# EAGLE design PCB-MicroVU (EAGLE 7.5.0)
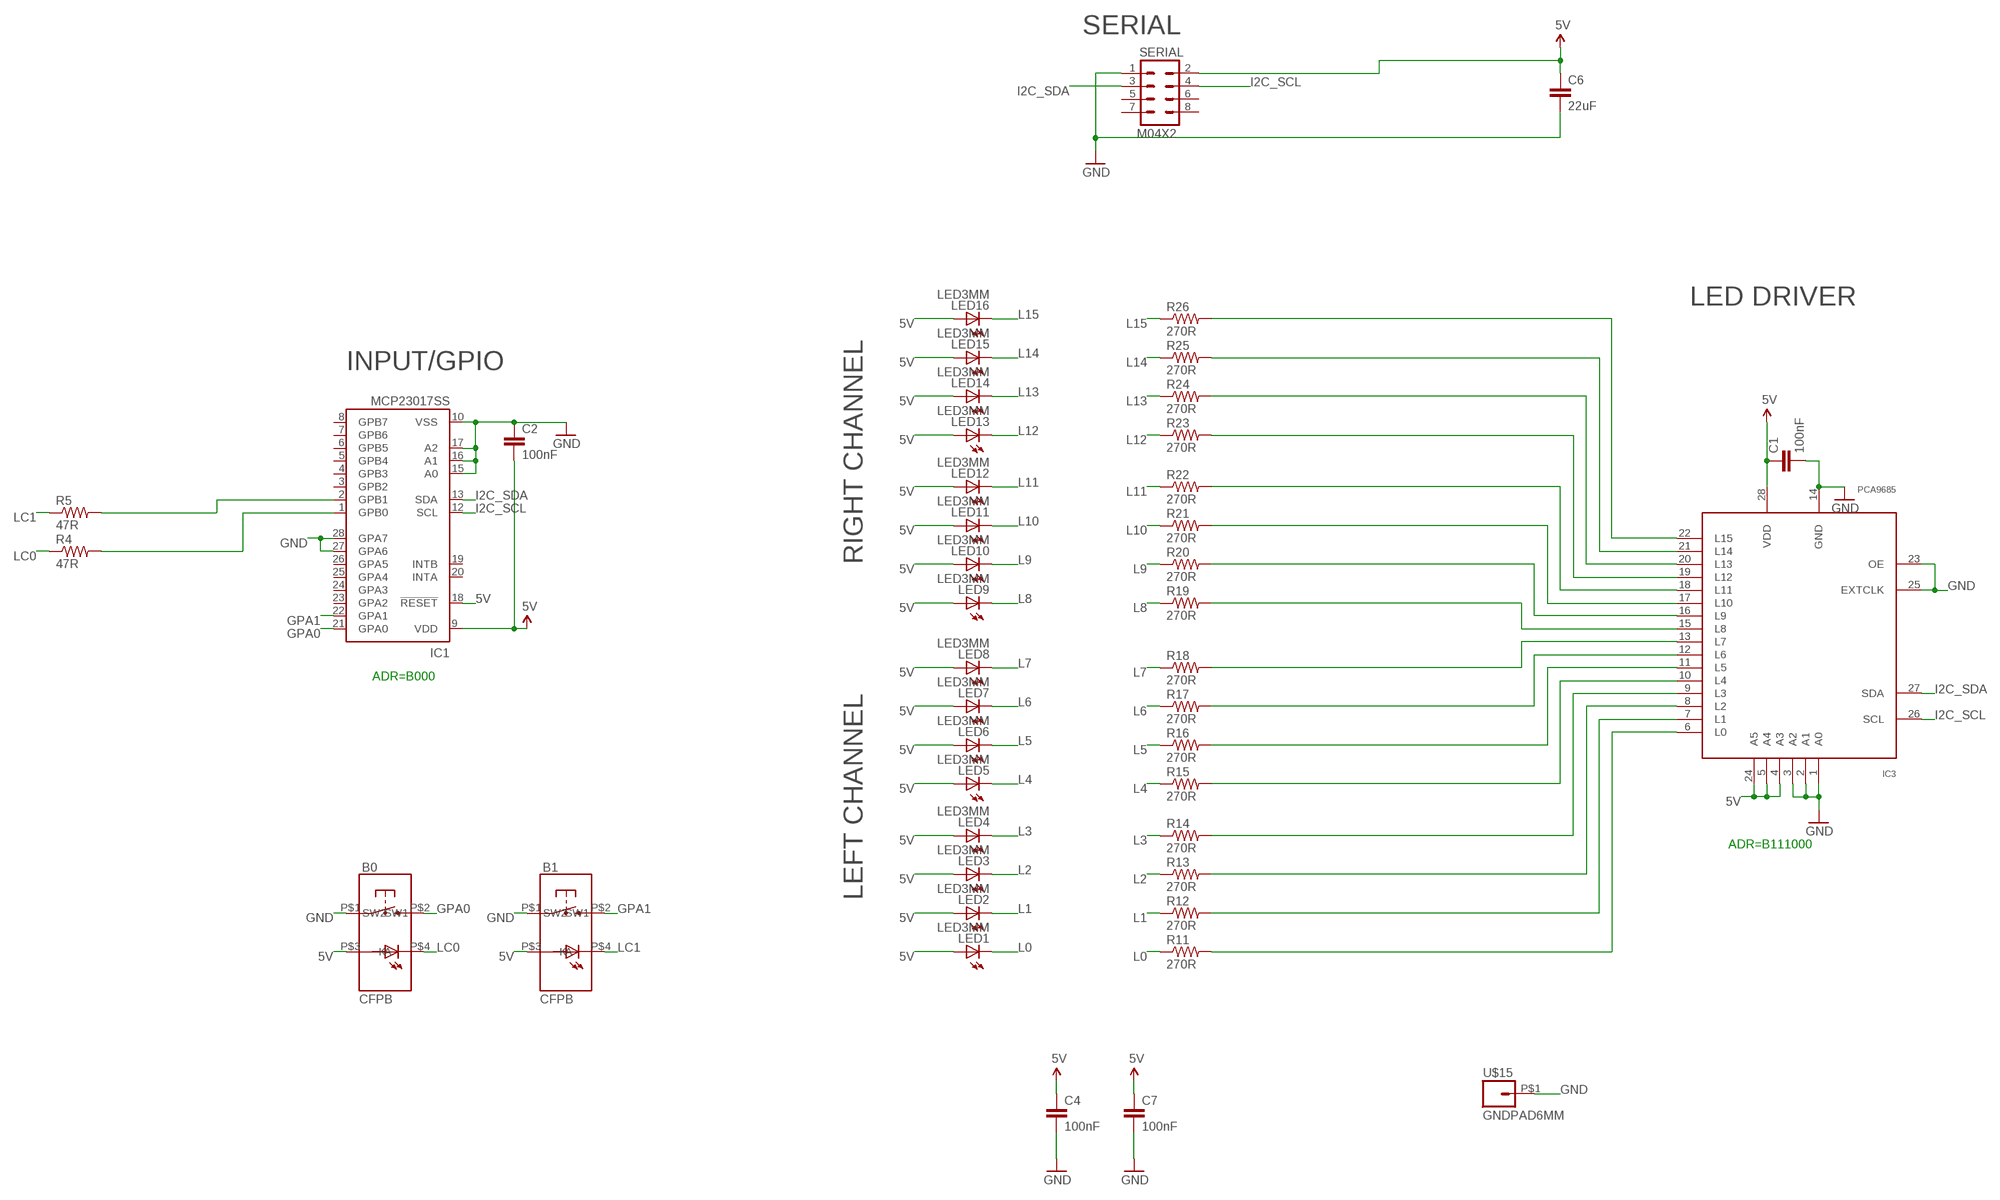
[diagram p0: schematic, sheet 1]

## Parts
B0  CFPB  [CFPB-6/9MM]
B1  CFPB  [CFPB-6/9MM]
C1  100nF  CAP0603-CAP  [0603-CAP]
C2  100nF  CAP0603-CAP  [0603-CAP]
C4  100nF  CAP0603-CAP  [0603-CAP]
C6  22uF  CAP0805  [0805]
C7  100nF  CAP0603-CAP  [0603-CAP]
IC1  MCP23017SS  [SSOP28]
IC3  PCA9685  [TSSOP28]
LED1  LED3MM  [LED3MM]
LED2  LED3MM  [LED3MM]
LED3  LED3MM  [LED3MM]
LED4  LED3MM  [LED3MM]
LED5  LED3MM  [LED3MM]
LED6  LED3MM  [LED3MM]
LED7  LED3MM  [LED3MM]
LED8  LED3MM  [LED3MM]
LED9  LED3MM  [LED3MM]
LED10  LED3MM  [LED3MM]
LED11  LED3MM  [LED3MM]
LED12  LED3MM  [LED3MM]
LED13  LED3MM  [LED3MM]
LED14  LED3MM  [LED3MM]
LED15  LED3MM  [LED3MM]
LED16  LED3MM  [LED3MM]
R4  47R  RESISTOR0603-RES  [0603-RES]
R5  47R  RESISTOR0603-RES  [0603-RES]
R11  270R  RESISTOR0603-RES  [0603-RES]
R12  270R  RESISTOR0603-RES  [0603-RES]
R13  270R  RESISTOR0603-RES  [0603-RES]
R14  270R  RESISTOR0603-RES  [0603-RES]
R15  270R  RESISTOR0603-RES  [0603-RES]
R16  270R  RESISTOR0603-RES  [0603-RES]
R17  270R  RESISTOR0603-RES  [0603-RES]
R18  270R  RESISTOR0603-RES  [0603-RES]
R19  270R  RESISTOR0603-RES  [0603-RES]
R20  270R  RESISTOR0603-RES  [0603-RES]
R21  270R  RESISTOR0603-RES  [0603-RES]
R22  270R  RESISTOR0603-RES  [0603-RES]
R23  270R  RESISTOR0603-RES  [0603-RES]
R24  270R  RESISTOR0603-RES  [0603-RES]
R25  270R  RESISTOR0603-RES  [0603-RES]
R26  270R  RESISTOR0603-RES  [0603-RES]
SERIAL  M04X2  [2X4]
U$15  GNDPAD6MM  [3.2MMPAD6MM]

## Nets
5V [Power]: B0.P$3(A) B1.P$3(A) C1.1 C2.2 C4.1 C6.1 C7.1 IC1.9(VDD) IC1.18(!RESET) IC3.4(A3) IC3.5(A4) IC3.24(A5) IC3.28(VDD) LED1.A LED2.A LED3.A LED4.A LED5.A LED6.A LED7.A LED8.A LED9.A LED10.A LED11.A LED12.A LED13.A LED14.A LED15.A LED16.A SERIAL.2
GND [Power]: B0.P$1(SW1) B1.P$1(SW1) C1.2 C2.1 C4.2 C6.2 C7.2 IC1.10(VSS) IC1.15(A0) IC1.16(A1) IC1.17(A2) IC1.27(GPA6) IC1.28(GPA7) IC3.1(A0) IC3.2(A1) IC3.3(A2) IC3.14(GND) IC3.23(OE) IC3.25(EXTCLK) SERIAL.1 U$15.P$1
GPA0 [Signal]: B0.P$2(SW2) IC1.21(GPA0)
GPA1 [Signal]: B1.P$2(SW2) IC1.22(GPA1)
I2C_SCL: IC1.12(SCL) IC3.26(SCL) SERIAL.4
I2C_SDA: IC1.13(SDA) IC3.27(SDA) SERIAL.3
L0: LED1.K(C) R11.1
L1: LED2.K(C) R12.1
L2: LED3.K(C) R13.1
L3: LED4.K(C) R14.1
L4: LED5.K(C) R15.1
L5: LED6.K(C) R16.1
L6: LED7.K(C) R17.1
L7: LED8.K(C) R18.1
L8: LED9.K(C) R19.1
L9: LED10.K(C) R20.1
L10: LED11.K(C) R21.1
L11: LED12.K(C) R22.1
L12: LED13.K(C) R23.1
L13: LED14.K(C) R24.1
L14: LED15.K(C) R25.1
L15: LED16.K(C) R26.1
LC0: B0.P$4(K) R4.1
LC1: B1.P$4(K) R5.1
N$1: IC1.2(GPB1) R5.2
N$16: IC1.1(GPB0) R4.2
N$22: IC3.6(L0) R11.2
N$27: IC3.19(L12) R23.2
N$29: IC3.21(L14) R25.2
N$37: IC3.13(L7) R18.2
N$38: IC3.12(L6) R17.2
N$39: IC3.11(L5) R16.2
N$40: IC3.10(L4) R15.2
N$41: IC3.9(L3) R14.2
N$42: IC3.8(L2) R13.2
N$43: IC3.7(L1) R12.2
N$45: IC3.15(L8) R19.2
N$46: IC3.16(L9) R20.2
N$47: IC3.17(L10) R21.2
N$48: IC3.18(L11) R22.2
N$50: IC3.20(L13) R24.2
N$52: IC3.22(L15) R26.2
Unconnected: IC1.3(GPB2) IC1.4(GPB3) IC1.5(GPB4) IC1.6(GPB5) IC1.7(GPB6) IC1.8(GPB7) IC1.19(INTB) IC1.20(INTA) IC1.23(GPA2) IC1.24(GPA3) IC1.25(GPA4) IC1.26(GPA5) SERIAL.5 SERIAL.6 SERIAL.7 SERIAL.8

## Notes on the sheet
- SERIAL
- LED DRIVER
- INPUT/GPIO
- RIGHT CHANNEL
- ADR=B000
- ADR=B111000
- LEFT CHANNEL

## Library data of the parts
B0 B1 = SKAARHOJ:CFPB
C1 C2 C4 C6 C7 = SparkFun:CAP: Capacitor Standard 0603 ceramic capacitor, and 0.1" leaded capacitor.
IC1 = microchip:MCP23017: http://ww1.microchip.com/downloads/en/DeviceDoc/21952a.pdf Source: http://ww1.microchip.com/downloads/en/DeviceDoc/21952a.pdf; MF: MICROCHIP; MPN: MCP23017-E/SS; OC_FARNELL: 1467674; OC_NEWARK: 31K2960
IC3 = wsmith:PCA9685
LED1-LED16 = SKAARHOJ:LED: KINGBRIGHT 20MM BIG LAMP
R4 R5 R11-R26 = SparkFun:RESISTOR: Resistor Basic schematic elements and footprints for 0603, 1206, and PTH resistors.
SERIAL = SparkFun:M04X2
U$15 = SKAARHOJ:GNDPAD

## Net classes
0 default: width 0.203 mm, drill 0.406 mm, clearance 0.152 mm
1 Power: width 0.406 mm, drill 0.61 mm, clearance 0.203 mm
2 Signal: width 0.203 mm, clearance 0.203 mm

## Board
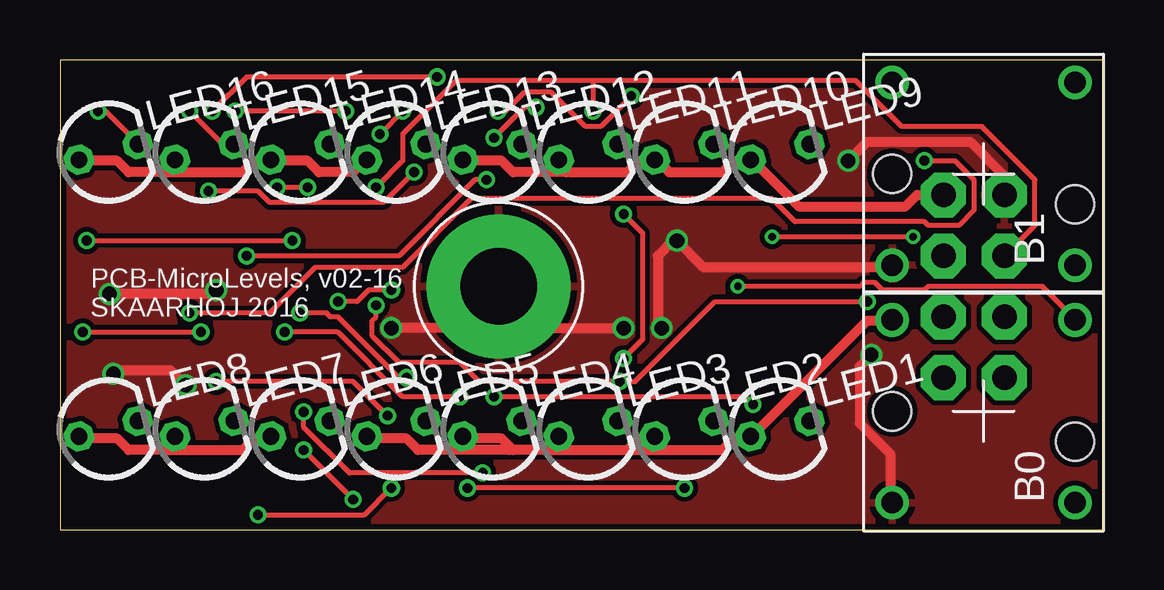
[diagram p1: board, top side]
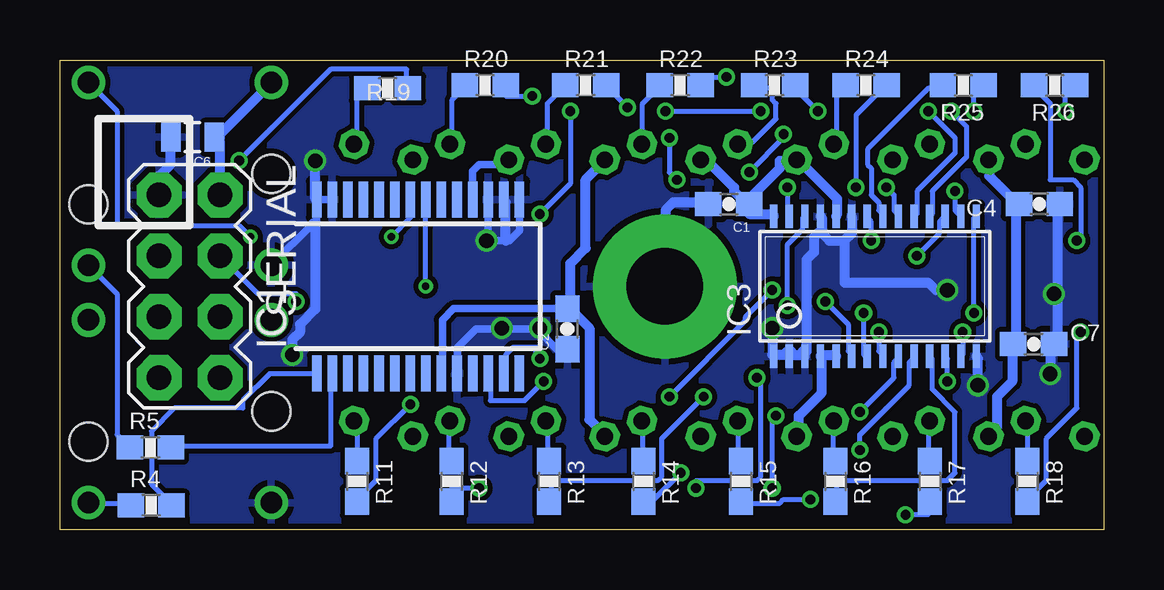
[diagram p2: board, bottom side, seen from below]

Size 43.5 x 19.6 mm. Coordinates in mm from the lower left corner, seen from the top.
Outline: 0,0 43.5,0 43.5,19.6 0,19.6 0,0
Copper layers (1*16): Top 0.035mm / dielectric 1.5mm / Bottom 0.035mm
Design rules "Fusion_eagle_rule_v1.1": minimum track width 6mil, minimum drill 12mil, track to track 6mil, track to pad 6mil, pad to pad 6mil, via to via 6mil, smd to smd 0mil, copper to edge 10mil, drill to drill 10mil, minimum pad ring 10mil, minimum via ring 6mil, stop-mask expansion 2mil, vias tented up to drill 100mil, thermal gap 10mil

### Footprints (pad centres in the part's own frame; a part is rotated, then mirrored left to right if it is on the bottom)
CFPB-6/9MM = drill 0.9: P$1 -3.81,3.81; P$2 3.81,-3.81; P$3 3.81,3.81; P$4 -3.81,-3.81 | hole 1.6: 0,3.81; -1.27,-3.81
0603-CAP = smd 1.1 x 1: 1 -0.85,0; 2 0.85,0
0805 = smd 0.8 x 1.2: 1 -0.9,0; 2 0.9,0
SSOP28 = smd 0.4 x 1.5: 1 -4.225,-3.625; 2 -3.575,-3.625; 3 -2.925,-3.625; 4 -2.275,-3.625; 5 -1.625,-3.625; 6 -0.975,-3.625; 7 -0.325,-3.625; 8 0.325,-3.625; 9 0.975,-3.625; 10 1.625,-3.625; 11 2.275,-3.625; 12 2.925,-3.625; 13 3.575,-3.625; 14 4.225,-3.625; 15 4.225,3.625; 16 3.575,3.625; 17 2.925,3.625; 18 2.275,3.625; 19 1.625,3.625; 20 0.975,3.625; 21 0.325,3.625; 22 -0.325,3.625; 23 -0.975,3.625; 24 -1.625,3.625; 25 -2.275,3.625; 26 -2.925,3.625; 27 -3.575,3.625; 28 -4.225,3.625
TSSOP28 = smd 0.305 x 0.991: 1 -4.225,-2.918; 2 -3.575,-2.918; 3 -2.925,-2.918; 4 -2.275,-2.918; 5 -1.625,-2.918; 6 -0.975,-2.918; 7 -0.325,-2.918; 8 0.325,-2.918; 9 0.975,-2.918; 10 1.625,-2.918; 11 2.275,-2.918; 12 2.925,-2.918; 13 3.575,-2.918; 14 4.225,-2.918; 15 4.225,2.918; 16 3.575,2.918; 17 2.925,2.918; 18 2.275,2.918; 19 1.625,2.918; 20 0.975,2.918; 21 0.325,2.918; 22 -0.325,2.918; 23 -0.975,2.918; 24 -1.625,2.918; 25 -2.275,2.918; 26 -2.925,2.918; 27 -3.575,2.918; 28 -4.225,2.918
LED3MM = drill 0.7 pad 1.2 octagon: A -1.27,0; K 1.27,0
0603-RES = smd 1.1 x 1: 1 -0.85,0; 2 0.85,0
2X4 = drill 1.016 pad 1.88 octagon: 1 -3.81,-1.27; 2 -3.81,1.27; 3 -1.27,-1.27; 4 -1.27,1.27; 5 1.27,-1.27; 6 1.27,1.27; 7 3.81,-1.27; 8 3.81,1.27
3.2MMPAD6MM = drill 3.2 pad 6: P$1 0,0

### Placement (x,y rotation side)
B0  38.5,4.95 90 top
B1  38.5,14.85 90 top
C1  15.62,13.59 180 bottom
C2  22.35,8.38 90 bottom
C4  2.67,13.59 0 bottom
C6  37.97,16.38 180 bottom
C7  2.92,7.75 0 bottom
IC1  28.57,10.16 0 bottom
IC3  9.53,10.16 0 bottom
LED1  30.02,4.22 15 top
LED2  26.02,4.22 15 top
LED3  22.02,4.22 15 top
LED4  18.02,4.22 15 top
LED5  14.02,4.22 15 top
LED6  10.02,4.22 15 top
LED7  6.02,4.22 15 top
LED8  2.02,4.22 15 top
LED9  30.02,15.77 15 top
LED10  26.02,15.77 15 top
LED11  22.02,15.77 15 top
LED12  18.02,15.77 15 top
LED13  14.02,15.77 15 top
LED14  10.02,15.77 15 top
LED15  6.02,15.77 15 top
LED16  2.02,15.77 15 top
R4  39.7,1.02 0 bottom
R5  39.73,3.44 0 bottom
R11  31.11,2.03 270 bottom
R12  27.18,2.03 270 bottom
R13  23.11,2.03 270 bottom
R14  19.18,2.03 270 bottom
R15  15.11,2.03 270 bottom
R16  11.18,2.03 270 bottom
R17  7.24,2.03 270 bottom
R18  3.17,2.03 270 bottom
R19  29.84,18.41 0 bottom
R20  25.77,18.54 0 bottom
R21  21.58,18.54 0 bottom
R22  17.65,18.54 0 bottom
R23  13.71,18.54 0 bottom
R24  9.9,18.54 0 bottom
R25  5.85,18.54 180 bottom
R26  2.04,18.54 180 bottom
SERIAL  38.1,10.16 270 bottom
U$15  18.29,10.16 0 top

### Tracks (layer width: path | path; a pad name or v marks a point on that pad's centre or on a via)
5V
  Top 0.406: 18.81,3.41 18.89,3.33 20.16,3.33 | 18.81,3.41 18.41,3.81 16.83,3.81 LED4.A | 20.16,3.33 20.64,3.81 LED3.A | 23.73,3.41 23.65,3.33 20.16,3.33 | 23.73,3.41 24.13,3.81 24.77,3.81 LED2.A | 23.73,3.41 23.81,3.33 27.62,3.33 28.1,3.81 28.73,3.81 LED1.A 28.89,3.97 33.66,8.73 34.61,8.73 B0.P$3 | LED5.A 12.86,3.81 14.45,3.81 14.92,3.33 18.73,3.33 18.81,3.41 | 4.29,3.33 2.86,3.33 2.38,3.81 0.79,3.81 LED8.A | 4.29,3.33 4.76,3.81 LED7.A | 4.29,3.33 7.62,3.33 8.1,3.81 8.73,3.81 LED6.A | 4.29,14.92 2.86,14.92 2.38,15.4 0.79,15.4 LED16.A | 4.29,14.92 4.76,15.4 LED15.A | 4.29,14.92 7.62,14.92 8.1,15.4 8.73,15.4 LED14.A 8.89,15.4 10.32,15.4 10.79,14.92 12.22,14.92 12.7,15.4 LED13.A | LED12.A 16.83,15.4 18.41,15.4 18.89,14.92 21.11,14.92 LED11.A 20.8,15.4 21.27,14.92 23.65,14.92 24.13,15.4 24.61,15.4 LED10.A 24.92,15.4 25.4,14.92 27.62,14.92 28.1,15.4 28.73,15.4 LED9.A 28.89,15.4 30.8,13.49 35.24,13.49 35.72,13.97 SERIAL.2
  Bottom 0.305: C2.2 27.09,9.23 27.56,8.76 27.56,6.58 IC1.9 | IC1.18 26.3,14.97 26.04,15.24 24.99,15.24 LED10.A
  Bottom 0.406: IC3.5 11.27,7.3 11.75,7.3 IC3.4 11.75,7.14 11.75,5.71 12.7,4.76 12.7,3.97 LED5.A | LED15.A 4.76,15.4 4.76,14.76 3.65,13.65 C4.1 3.65,13.49 3.65,7.78 C7.1 3.81,7.62 3.81,6.19 4.45,5.56 4.45,4.29 4.76,3.97 LED7.A | SERIAL.2 36.83,16.19 36.99,16.35 C6.1 36.83,16.35 36.83,16.51 34.77,18.57 B1.P$3 | IC3.24 11.11,13.18 11.11,13.81 12.7,15.4 LED13.A 12.86,15.4 13.49,15.4 13.49,15.08 14.61,13.97 14.61,13.65 C1.1 | IC3.28 13.81,13.18 14.76,13.18 14.76,13.49 C1.1 | C1.1 14.92,13.65 15.4,14.13 15.4,14.29 16.67,15.56 LED12.A | LED11.A 20.8,15.4 21.59,14.61 21.59,11.75 22.23,11.11 22.23,9.37 C2.2 22.23,9.21 21.43,8.41 21.43,4.6 20.8,3.97 LED3.A
GND  (via drill 0.61)
  Top 0.406: B1.P$1 34.61,10.95 26.83,10.95 v25.72,12.06 25.56,12.06 24.92,11.43 24.92,8.57 v25.08,8.41 | v33.81,7.3 33.34,6.83 33.34,4.45 34.61,3.17 34.61,1.27 B0.P$1 | SERIAL.1 39.37,14.76 37.94,16.19 33.66,16.19 v32.86,15.4 | v5.24,6.03 4.6,6.67 2.38,6.67 v2.22,6.51 | v13.81,8.41 16.51,8.41 18.26,10.16 U$15.P$1 18.41,10 20,8.41 v23.5,8.41 | v2.06,9.84 6.35,9.84 v6.51,10
  Bottom 0.305: C2.1 22.77,7.53 23.57,8.33 23.62,8.38 25.08,8.38 26.16,8.38 26.92,7.62 26.92,6.56 IC1.10 | IC1.15 24.35,12.48 24.77,12.06 24.92,12.06 25.4,12.06 25.64,12.3 25.65,12.32 IC1.17 | IC1.27 IC1.28 32.8,12.93 32.95,12.78 B1.P$1
  Bottom 0.406: SERIAL.1 39.37,14.76 38.89,15.24 38.89,16.35 C6.2 | 24.92,12.06 24.92,13.65 IC1.16 | v25.72,12.06 25.72,12.22 25.64,12.3 | v33.81,7.3 33.81,7.94 33.5,8.26 33.5,8.57 32.86,9.21 32.86,12.7 32.95,12.78 | v25.08,8.41 25.08,8.38 | v32.86,15.4 32.86,13.81 IC1.28 | v5.24,6.03 5.24,7.14 IC3.14 | v2.22,6.51 2.22,7.62 C7.2 1.91,7.78 1.91,9.84 | 1.91,9.84 1.91,13.49 C4.2 | 10.79,12.06 10.48,12.38 10.48,13.02 IC3.23 | 10.79,12.06 11.43,12.06 11.75,12.38 | 11.75,12.38 11.75,13.02 IC3.25 | 11.75,12.38 11.91,12.38 12.06,12.22 12.06,11.59 12.38,11.27 12.38,7.46 12.54,7.46 IC3.3 12.54,7.3 13.02,7.3 IC3.2 13.02,7.46 13.18,7.46 13.34,7.3 13.65,7.3 IC3.1 13.81,7.3 v13.81,8.41 | U$15.P$1 18.26,10.16 18.26,13.34 17.94,13.65 16.51,13.65 C1.2 | v6.51,10 6.99,10 7.3,10.32 10.79,10.32 10.79,12.06 | v2.06,9.84 1.91,9.84 | v23.5,8.41 23.57,8.33
  pour Top: 0,0 43.81,0 43.81,19.68 0,19.68
  pour Bottom: 0,0 43.81,0 43.81,19.68 0,19.68
GPA0  (via drill 0.3)
  Top 0.203: v28.26,10.16 33.34,10.16 33.5,10.32 33.97,10.32 34.29,10 36.04,10 36.2,10.16 40.96,10.16 42.23,8.89 B0.P$2
  Bottom 0.203: v28.26,10.16 28.26,13.65 IC1.21
GPA1  (via drill 0.3)
  Top 0.203: v35.56,12.22 v29.69,12.22
  Bottom 0.203: v29.69,12.22 28.89,13.02 28.89,13.65 IC1.22 | v35.56,12.22 36.04,12.7 41.12,12.7 41.12,17.46 42.23,18.57 B1.P$2
I2C_SCL  (via drill 0.41)
  Top 0.203: v13.18,9.37 13.18,8.89 13.02,8.73 13.02,8.1 14.13,6.99 16.67,6.99 17.46,6.19 v23.34,6.19 23.97,6.19 27.3,9.53 v33.66,9.53
  Bottom 0.203: v13.18,9.37 13.18,11.91 12.54,12.54 12.54,13.02 IC3.26 | v23.34,6.19 24.13,5.4 25.56,5.4 25.56,6.51 IC1.12 | SERIAL.4 35.24,9.84 33.66,9.84 v33.66,9.53
I2C_SDA  (via drill 0.41)
  Top 0.203: v13.18,14.29 14.29,15.4 14.29,16.51 16.51,18.73 22.23,18.73 | 22.23,18.73 33.18,18.73 35.08,16.83 38.42,16.83 40.64,14.61 40.64,12.7 SERIAL.3 | v23.5,7.14 24.29,7.94 24.29,12.38 v23.5,13.18 | 22.23,18.73 v22.23,17.46
  Bottom 0.203: v13.18,14.29 13.18,13.18 IC3.27 | v23.5,7.14 23.65,7.3 23.65,7.62 24.61,7.62 24.92,7.3 24.92,6.67 IC1.13 | v23.5,13.18 22.23,14.45 v22.23,17.46
L0
  Bottom 0.203: R11.1 31.11,4.45 LED1.K
L1
  Bottom 0.203: R12.1 27.3,3.02 27.3,4.45 LED2.K
L2
  Bottom 0.203: R13.1 23.18,3.02 23.18,4.45 LED3.K
L3
  Bottom 0.203: R14.1 19.21,3.02 19.21,4.45 LED4.K
L4
  Bottom 0.203: R15.1 15.24,3.02 15.24,4.45 LED5.K
L5
  Bottom 0.203: R16.1 11.27,3.02 11.27,4.45 LED6.K
L6
  Bottom 0.203: R17.1 7.3,3.02 7.3,4.45 LED7.K
L7
  Bottom 0.203: R18.1 3.17,4.45 LED8.K
L8
  Bottom 0.203: R19.1 30.8,18.41 31.11,18.1 31.11,16.19 LED9.K
L9
  Bottom 0.203: R20.1 26.67,18.41 27.15,17.94 27.15,16.19 LED10.K
L10
  Bottom 0.203: R21.1 22.54,18.41 23.18,17.78 23.18,16.19 LED11.K
L11
  Bottom 0.203: R22.1 18.57,18.41 19.21,17.78 19.21,16.19 LED12.K
L12
  Bottom 0.203: R23.1 14.45,18.41 13.81,18.41 13.81,17.94 13.65,17.78 13.65,17.14 14.61,16.19 15.24,16.19 LED13.K
L13
  Bottom 0.203: R24.1 10.79,18.41 11.11,18.1 11.11,16.19 LED14.K
L14  (via drill 0.41)
  Top 0.203: v5.4,17.46 6.67,16.19 7.14,16.19 LED15.K
  Bottom 0.203: v5.4,17.46 5.4,18.1 5.08,18.41 R25.1
L15  (via drill 0.41)
  Top 0.203: v1.59,17.46 1.91,17.46 3.17,16.19 LED16.K
  Bottom 0.203: v1.59,17.46 1.59,18.1 1.27,18.41 R26.1
LC0
  Bottom 0.203: R4.1 40.64,1.11 42.23,1.11 B0.P$4
LC1
  Bottom 0.203: R5.1 40.64,3.49 41.12,3.97 41.12,9.84 42.23,10.95 B1.P$4
N$1
  Bottom 0.203: R5.2 38.73,3.49 32.23,3.49 32.23,6.51 IC1.2
N$16
  Bottom 0.203: R4.2 38.89,1.11 39.69,1.91 39.69,4.13 38.73,5.08 35.88,5.08 35.88,5.4 34.77,6.51 32.86,6.51 IC1.1
N$22  (via drill 0.41)
  Top 0.203: v11.59,9.53 12.38,9.53 12.86,10 v13.81,10 | v18.1,5.56 28.57,5.56 v28.89,5.24
  Bottom 0.203: v11.59,9.53 10.64,8.57 10.64,7.46 10.48,7.3 IC3.6 | v13.81,10 14.92,8.89 14.92,8.73 v18.1,5.56 | v28.89,5.24 30.32,3.81 30.32,2.06 31.11,1.27 R11.2
N$27  (via drill 0.41)
  Top 0.203: v11.91,17.46 v7.3,17.46
  Bottom 0.203: v7.3,17.46 6.19,16.35 6.19,15.72 7.78,14.13 7.78,13.18 IC3.19 | v11.91,17.46 12.86,18.41 R23.2
N$29
  Bottom 0.203: IC3.21 9.21,13.18 9.37,13.34 9.37,13.65 9.68,13.97 9.68,15.08 9.84,15.24 9.84,15.88 7.3,18.41 6.83,18.41 R25.2
N$37  (via drill 0.41)
  Top 0.203: v0.95,8.26 v5.87,8.26
  Bottom 0.203: v5.87,8.26 5.87,7.3 IC3.13 | v0.95,8.26 1.11,8.1 1.11,5.08 2.38,3.81 2.38,2.06 3.17,1.27 R18.2
N$38  (via drill 0.41)
  Top 0.203: v6.51,6.19 12.22,6.19 v13.65,4.76 | v13.81,1.75 12.7,0.64 v8.26,0.64
  Bottom 0.203: v6.51,6.19 6.51,7.14 IC3.12 | v13.65,4.76 13.81,4.6 v13.81,1.75 | v8.26,0.64 7.3,0.64 7.3,1.11 R17.2
N$39
  Bottom 0.203: IC3.11 7.14,7.14 7.14,5.87 6.19,4.92 6.19,2.38 6.51,2.06 11.11,2.06 11.11,1.27 R16.2
N$40  (via drill 0.41)
  Top 0.203: v12.22,1.27 v10.16,3.33
  Bottom 0.203: v10.16,3.33 10.16,3.97 8.1,6.03 8.1,6.99 7.94,7.14 IC3.10 | v12.22,1.27 13.34,1.27 13.49,1.11 15.08,1.11 R15.2
N$41  (via drill 0.41)
  Top 0.203: v10.16,4.92 10.16,4.29 12.06,2.38 v17.62,2.38
  Bottom 0.203: v10.16,4.92 8.73,6.35 8.73,6.99 8.57,7.14 IC3.9 | v17.62,2.38 18.73,1.27 19.05,1.27 R14.2
N$42  (via drill 0.41)
  Top 0.203: v9.37,8.26 11.59,8.26 14.29,5.56 v16.67,5.56
  Bottom 0.203: v9.37,8.26 9.37,7.46 9.21,7.3 IC3.8 | v16.67,5.56 18.41,3.81 18.41,2.22 18.57,2.06 23.02,2.06 23.02,1.27 R13.2
N$43  (via drill 0.41)
  Top 0.203: v10,9.05 11.11,9.05 11.27,8.89 11.59,8.89 14.13,6.35 v14.45,6.35 | v26.04,1.75 v16.99,1.75
  Bottom 0.203: v10,9.05 10,7.3 IC3.7 | v14.45,6.35 14.29,6.19 14.29,2.22 14.45,2.06 16.99,2.06 v16.99,1.75 | v26.04,1.75 27.15,1.75 27.15,1.27 R12.2
N$45  (via drill 0.41)
  Top 0.203: v5.4,9.05 8.73,9.05 10.64,10.95 14.29,10.95 17.14,13.81 29.69,13.81 30.64,12.86 36.04,12.86 36.2,12.7 37.47,12.7 38.1,13.34 38.1,14.61 37.31,15.4 v36.04,15.4
  Bottom 0.203: v5.4,9.05 5.4,13.02 IC3.15 | v36.04,15.4 32.23,19.21 29.05,19.21 29.05,18.41 R19.2
N$46  (via drill 0.41)
  Top 0.203: v6.19,14.13 8.26,14.13 8.73,13.65 13.49,13.65 v14.76,14.92 | v14.29,17.46 v13.34,16.51 | v18.26,17.46 18.57,17.46 19.37,18.26 20.48,18.26 21.91,16.83 22.54,16.83 v23.81,18.1
  Bottom 0.203: v6.19,14.13 6.19,13.34 6.03,13.18 IC3.16 | v14.76,14.92 13.34,16.35 v13.34,16.51 | v18.26,17.46 v14.29,17.46 | v23.81,18.1 24.92,18.1 24.92,18.41 R20.2
N$47  (via drill 0.41)
  Top 0.203: v7.78,11.43 14.13,11.43 17.3,14.61 v17.78,14.61 | v18.1,16.35 19.37,17.62 v19.84,17.62
  Bottom 0.203: v7.78,11.43 6.83,12.38 6.83,12.86 6.67,13.02 IC3.17 | v17.78,14.61 18.1,14.92 v18.1,16.35 | v19.84,17.62 20.64,18.41 R21.2
N$48  (via drill 0.41)
  Top 0.203: v6.35,17.46 7.78,18.89 v15.72,18.89
  Bottom 0.203: v6.35,17.46 5.71,16.83 5.71,15.56 7.14,14.13 7.14,13.18 IC3.18 | v15.72,18.89 16.67,18.89 16.67,18.57 R22.2
N$50  (via drill 0.41)
  Top 0.203: v10.32,14.29 v9.05,14.29
  Bottom 0.203: v9.05,14.29 8.73,13.97 8.73,13.34 8.57,13.18 IC3.20 | v10.32,14.29 10.32,17.3 9.21,18.41 R24.2
N$52  (via drill 0.41)
  Top 0.203: v1.11,12.06 v9.68,12.06
  Bottom 0.203: v9.68,12.06 9.68,12.86 9.84,13.02 IC3.22 | v1.11,12.06 0.95,12.22 0.95,14.29 1.27,14.61 2.22,14.61 2.22,17.78 2.86,18.41 R26.2

### Text on the board
_tsilk: PCB-MicroLevels, v02-16 / SKAARHOJ 2016